# EAGLE design xport_shield_v1 (EAGLE 4.14)
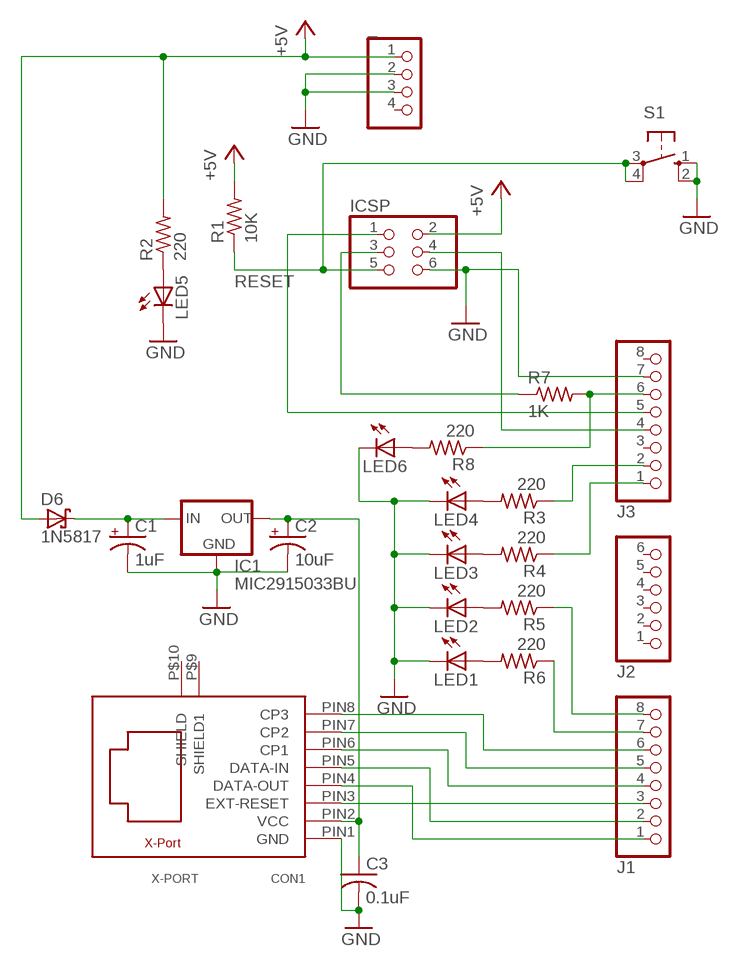
[diagram p0: schematic, sheet 1]

## Parts
_  PINHD-1X4  [1X04]
C1  1uF  CPOL-USE2.5-6  [E2,5-6]
C2  10uF  CPOL-USE2.5-6  [E2,5-6]
C3  0.1uF  2252MONOKAP  [2252MONOKAP]
CON1  X-PORT  [X-PORT]
D6  1N5817  SCHOTTKY-DIODE1N5817  [DO41-10]
IC1  MIC2915033BU  MIC29150XXBU  [TO-263]
ICSP  PINHD-2X3  [2X03]
J1  PINHD-1X8  [1X08]
J2  PINHD-1X6  [1X06]
J3  PINHD-1X8  [1X08]
LED1  LED3MM  [LED3MM]
LED2  LED3MM  [LED3MM]
LED3  LED3MM  [LED3MM]
LED4  LED3MM  [LED3MM]
LED5  LED3MM  [LED3MM]
LED6  LED3MM  [LED3MM]
R1  10K  R-US_0207/10  [0207/10]
R2  220  R-US_0207/10  [0207/10]
R3  220  R-US_0207/10  [0207/10]
R4  220  R-US_0207/10  [0207/10]
R5  220  R-US_0207/10  [0207/10]
R6  220  R-US_0207/10  [0207/10]
R7  1K  R-US_0207/10  [0207/10]
R8  220  R-US_0207/10  [0207/10]
S1  10-XX  [B3F-10XX]

## Nets
+5V: _.1 D6.A ICSP.2 R1.2 R2.2
GND: _.2 _.3 C1.- C2.- C3.P$2(-) CON1.PIN1(GND) IC1.P$2(GND) ICSP.6 J3.7 LED1.K(C) LED2.K(C) LED3.K(C) LED4.K(C) LED5.K(C) LED6.K(C) S1.1(S) S1.2(S1)
N$1: ICSP.5 R1.1 S1.3(P) S1.4(P1)
N$2: J3.6 R7.2 R8.1
N$3: ICSP.3 R7.1
N$4: ICSP.1 J3.5
N$5: ICSP.4 J3.4
N$6: C1.+ D6.C IC1.P$1(IN)
N$7: CON1.PIN3(EXT-RESET) J1.3
N$8: CON1.PIN4(DATA-OUT) J1.1
N$9: CON1.PIN5(DATA-IN) J1.2
N$10: CON1.PIN6(CP1) J1.4
N$11: CON1.PIN7(CP2) J1.5
N$12: CON1.PIN8(CP3) J1.6
N$13: LED4.A R3.2
N$14: LED3.A R4.2
N$15: LED2.A R5.2
N$16: LED1.A R6.2
N$17: LED5.A R2.1
N$18: C2.+ C3.P$1(+) CON1.PIN2(VCC) IC1.P$3(OUT)
N$19: J1.7 R6.1
N$20: J1.8 R5.1
N$21: J3.1 R4.1
N$22: J3.2 R3.1
N$23: LED6.A R8.2
Unconnected: _.4 CON1.P$9(SHIELD1) CON1.P$10(SHIELD) J2.1 J2.2 J2.3 J2.4 J2.5 J2.6 J3.3 J3.8

## Notes on the sheet
- RESET

## Library data of the parts
_ = pinhead:PINHD-1X4: PIN HEADER
C1 C2 = rcl:CPOL-US: POLARIZED CAPACITOR, American symbol
C3 = caps-bc-mono:2252MONOKAP
CON1 = x-port:X-PORT: LAN <-> RS232
D6 = diode-tom-extended:SCHOTTKY-DIODE: Schottky Diode
IC1 = v-reg-micrel-tom-extended:MIC29150XXBU
ICSP = pinhead:PINHD-2X3: PIN HEADER
J1 J3 = pinhead:PINHD-1X8: PIN HEADER
J2 = pinhead:PINHD-1X6: PIN HEADER
LED1-LED6 = led:LED: LED OSRAM: - CHIPLED LG R971, LG N971, LY N971, LG Q971, LY Q971, LO R971, LY R971 LH N974, LH R974 LS Q976, LO Q976, LY Q976 LO Q996 - Hyper CHIPLED LW Q18S LB Q993, LB Q99A, LB R99A - SideLED LS A670, LO A670, LY A670, LG A670, LP A670 LB A673, LV A673, LT A673, LW A673 LH A674 LY A675 LS A676, LA A676, LO A676, LY A676, LW A676 LS A679, LY A679, LG A679 - Hyper Micro SIDELED® LS Y876, LA Y876, LO Y876, LY Y876 LT Y87S - SmartLED LW L88C, LW L88S LB L89C, LB L89S, LG L890 LS L89K, LO L89K, LY L89K LS L896, LA L896, LO L896, LY L896 - TOPLED LS T670, LO T670, LY T670, LG T670, LP T670 LSG T670, LSP T670, LSY T670, LOP T670, LYG T670 LG T671, LOG T671, LSG T671 LB T673, LV T673, LT T673, LW T673 LH T674 LS T676, LA T676, LO T676, LY T676, LB T676, LH T676, LSB T676, LW T676 LB T67C, LV T67C, LT T67C, LS T67K, LO T67K, LY T67K, LW E67C LS E67B, LA E67B, LO E67B, LY E67B, LB E67C, LV E67C, LT E67C LW T67C LS T679, LY T679, LG T679 LS T770, LO T770, LY T770, LG T770, LP T770 LB T773, LV T773, LT T773, LW T773 LH T774 LS E675, LA E675, LY E675, LS T675 LS T776, LA T776, LO T776, LY T776, LB T776 LHGB T686 LT T68C, LB T68C - Hyper Mini TOPLED® LB M676 - Mini TOPLED Santana® LG M470 LS M47K, LO M47K, LY M47K Source: http://www.osram.convergy.de/
R1-R8 = rcl:R-US_: RESISTOR, American symbol
S1 = switch-omron:10-XX: OMRON SWITCH

## Board
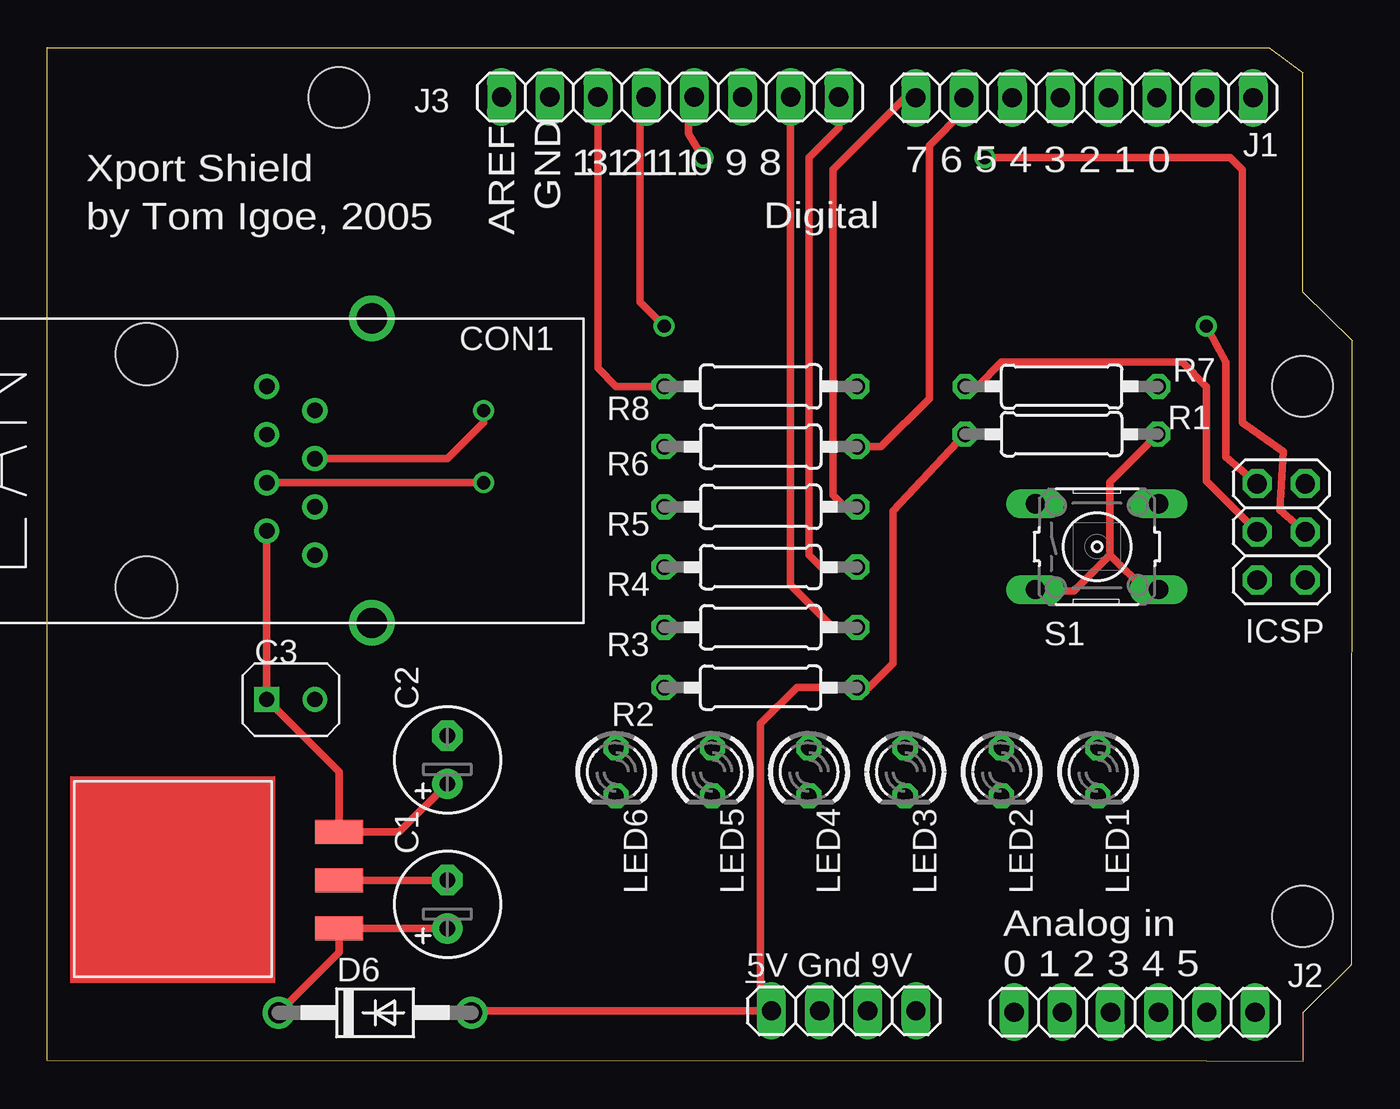
[diagram p1: board, top side]
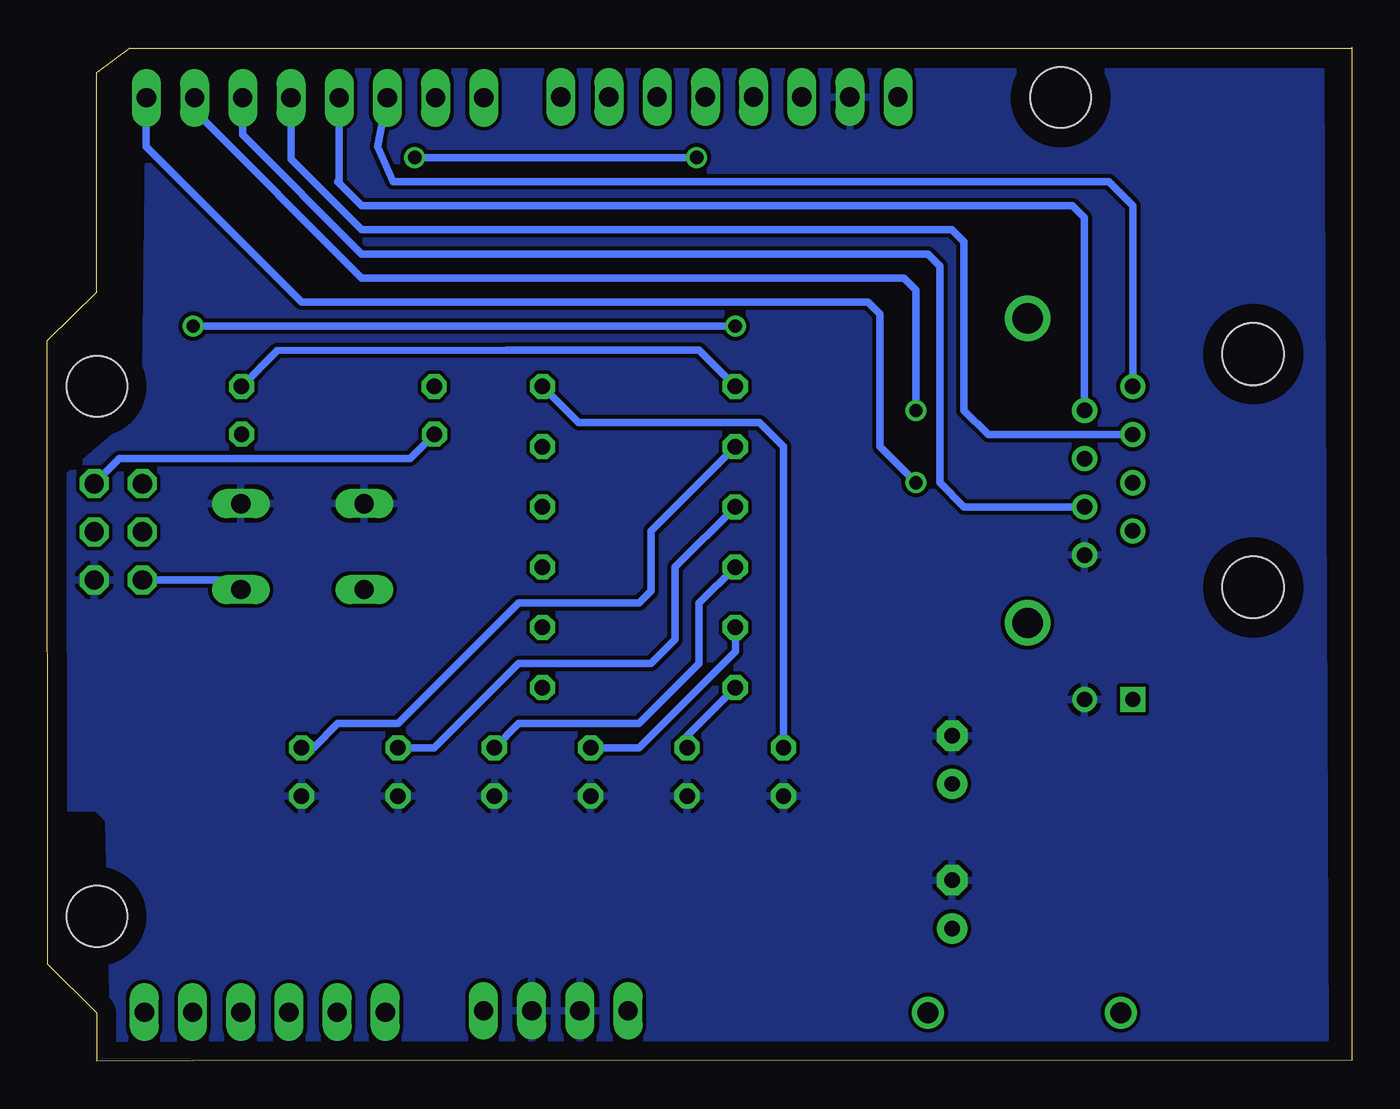
[diagram p2: board, bottom side, seen from below]

Size 68.77 x 53.44 mm. Coordinates in mm from the lower left corner, seen from the top.
Outline: 0,53.4 64.44,53.4 66.17,52.1 66.17,40.54 68.77,38 68.75,5.11
Outline: 0,53.4 0,53.44
Outline: 68.75,5.1 68.75,5.11
Outline: 68.75,5.11 66.17,2.55 66.19,0.05
Outline: 0,53.4 0,0.05 61.09,0.01 66.19,0
Copper layers (1*16): Top 0.035mm / dielectric 1.5mm / Bottom 0.035mm
Design rules "default": minimum track width 10mil, minimum drill 24mil, track to track 8mil, track to pad 8mil, pad to pad 8mil, via to via 8mil, smd to smd 8mil, copper to edge 40mil, drill to drill 10mil, minimum pad ring 10mil, minimum via ring 8mil, stop-mask expansion 4mil, vias tented up to drill 0mil, thermal gap 10mil
Holes 3.2 mm at 15.37,50.81 66.17,35.57 66.17,7.63

### Footprints (pad centres in the part's own frame; a part is rotated, then mirrored left to right if it is on the bottom)
1X04 = drill 1.016 long: 1 -3.81,0; 2 -1.27,0; 3 1.27,0; 4 3.81,0
E2,5-6 = drill 0.813 pad 1.6 round: + -1.27,0 | drill 0.813 pad 1.6 octagon: - 1.27,0
2252MONOKAP = drill 0.8 square: P$1 -2.54,-0.635 | drill 0.8 round: P$2 0,-0.635
X-PORT = drill 1.6 round: P$9 4.28,8.025; P$10 4.28,-8.025 | drill 0.813 round: PIN1 1.27,-4.445; PIN2 -1.27,-3.175; PIN3 1.27,-1.905; PIN4 -1.27,-0.635; PIN5 1.27,0.635; PIN6 -1.27,1.905; PIN7 1.27,3.175; PIN8 -1.27,4.445 | hole 3.25: -7.62,-6.15; -7.62,6.15
DO41-10 = drill 1.118 round: A 5.08,0; C -5.08,0
TO-263 = smd 1.27 x 2.54: P$1 -2.54,-8.89; P$2 0,-8.89; P$3 2.54,-8.89
2X03 = drill 1.016 octagon: 1 -2.54,-1.27; 2 -2.54,1.27; 3 0,-1.27; 4 0,1.27; 5 2.54,-1.27; 6 2.54,1.27
1X08 = drill 1.016 long: 1 -8.89,0; 2 -6.35,0; 3 -3.81,0; 4 -1.27,0; 5 1.27,0; 6 3.81,0; 7 6.35,0; 8 8.89,0
1X06 = drill 1.016 long: 1 -6.35,0; 2 -3.81,0; 3 -1.27,0; 4 1.27,0; 5 3.81,0; 6 6.35,0
LED3MM = drill 0.813 octagon: A -1.27,0; K 1.27,0
0207/10 = drill 0.813 octagon: 1 -5.08,0; 2 5.08,0
B3F-10XX = drill 1.016 long: 1 -3.251,2.261; 2 3.251,2.261; 3 -3.251,-2.261; 4 3.251,-2.261

### Placement (x,y rotation side)
_  41.97,2.65 0 top
C1  21.08,8.27 90 top
C2  21.08,15.89 90 top
C3  14.1,19.7 0 top
CON1  12.83,31.13 0 top
D6  17.27,2.55 0 top
IC1  6.48,9.54 90 top
ICSP  65.04,27.9 270 top
J1  54.67,50.79 180 top
J2  57.31,2.58 0 top
J3  32.83,50.83 180 top
LED1  55.38,15.25 270 top
LED2  50.3,15.25 270 top
LED3  45.22,15.25 270 top
LED4  40.14,15.25 270 top
LED5  35.05,15.25 270 top
LED6  29.97,15.25 270 top
R1  53.45,33.06 180 top
R2  37.6,19.7 0 top
R3  37.6,22.87 180 top
R4  37.6,26.05 180 top
R5  37.6,29.22 180 top
R6  37.6,32.4 180 top
R7  53.46,35.56 0 top
R8  37.6,35.57 0 top
S1  55.33,27.12 0 top

### Tracks (layer width: path | path; a pad name or v marks a point on that pad's centre or on a via)
+5V
  Top 0.406: D6.A 22.46,2.65 _.1 37.6,3.22 37.6,17.79 39.5,19.7 R2.2 43.31,19.7 44.58,20.97 44.58,29.01 R1.2
  Bottom 0.406: ICSP.2 64.99,31.76 49.66,31.76 48.39,33.03 48.39,33.04 R1.2
GND
  Top 0.406: IC1.P$2 C1.-
  pour Bottom: 1.65,52.21 63.38,52.21 63.63,34.3 68.07,30.49 68.07,13.35 66.17,13.35 65.53,12.71 65.28,1.15 1.4,1.15
N$1
  Top 0.406: R1.1 56.01,30.53 56.01,26.68 | S1.4 58.55,24.84 58.55,24.78 57.91,24.78 56.01,26.68 | S1.3 52.16,24.78 54.11,24.78 56.01,26.68
  Bottom 0.406: 58.55,24.86 58.55,24.78 | S1.4 58.55,24.86 | ICSP.5 58.55,25.36 58.55,24.86
N$2
  Top 0.406: J3.6 29.02,36.53 29.97,35.57 R8.1
  Bottom 0.406: R7.2 56.65,37.47 44.58,37.48 34.42,37.48 R8.1
N$3
  Top 0.406: ICSP.3 61.09,30.58 61.09,35.57 59.82,36.84 50.3,36.84 49.03,35.57 R7.1
N$4  (via drill 0.7)
  Top 0.406: ICSP.1 62.11,31.85 62.11,36.84 v61.09,38.75 | v32.52,38.75 31.24,40.02 31.24,50.18 J3.5
  Bottom 0.406: v32.52,38.75 v61.09,38.75
N$5  (via drill 0.7)
  Top 0.406: ICSP.4 64.96,29.06 65.15,32.14 63,33.67 63,47 62.36,47.64 v49.41,47.64 | J3.4 34.08,50.81 33.79,50.81 33.79,48.91 v34.55,47.64
  Bottom 0.406: v34.55,47.64 v49.41,47.64
N$6
  Top 0.406: C1.+ IC1.P$1 15.37,5.73 D6.C
N$7
  Bottom 0.406: J1.3 58.48,48.83 52.2,42.56 22.36,42.56 21.72,41.92 21.72,30.49 20.45,29.22 CON1.PIN3
N$8  (via drill 0.7)
  Top 0.406: CON1.PIN4 v22.99,30.49
  Bottom 0.406: J1.1 63.56,48.2 55.38,40.02 25.53,40.02 24.89,39.38 24.89,32.4 v22.99,30.49
N$9  (via drill 0.7)
  Top 0.406: v22.99,34.3 22.99,33.67 21.08,31.76 CON1.PIN5
  Bottom 0.406: J1.2 61.02,50.1 52.2,41.29 23.62,41.29 22.99,40.65 v22.99,34.3
N$10
  Bottom 0.406: J1.4 55.94,47.56 52.2,43.83 21.08,43.83 20.45,43.19 20.45,34.3 19.18,33.03 CON1.PIN6
N$11
  Bottom 0.406: J1.5 53.4,46.44 53.47,46.37 52.2,45.1 14.74,45.1 14.1,44.46 CON1.PIN7
N$12
  Bottom 0.406: J1.6 51.36,48.2 50.55,46.37 12.83,46.37 11.56,45.1 CON1.PIN8
N$13
  Bottom 0.406: R3.2 32.52,21.6 37.6,16.52 LED4.A
N$14
  Bottom 0.406: R4.2 34.42,24.14 34.42,20.97 37.6,17.79 43.95,17.79 LED3.A
N$15
  Bottom 0.406: R5.2 35.69,26.05 35.69,22.24 36.96,20.97 43.95,20.97 48.39,16.52 LED2.A
N$16
  Bottom 0.406: R6.2 36.96,27.95 36.96,24.78 37.6,24.14 43.95,24.14 50.3,17.79 53.47,17.79 54.74,16.52 LED1.A
N$17
  Bottom 0.406: R2.1 35.05,17.16 LED5.A
N$18
  Top 0.406: C2.+ 18.54,12.08 IC1.P$3 15.37,15.25 C3.P$1 CON1.PIN2
N$19
  Top 0.406: J1.7 48.32,50.1 46.48,48.27 46.48,34.94 43.95,32.4 R6.1
N$20
  Top 0.406: J1.8 45.19,50.79 41.41,47 41.41,29.86 42.04,29.22 R5.1
N$21
  Top 0.406: J3.1 41.72,49.22 40.14,47.64 40.14,26.68 40.77,26.05 R4.1
N$22
  Top 0.406: J3.2 39.18,25.1 41.41,22.87 R3.1
N$23
  Bottom 0.406: R8.2 40.77,33.67 31.24,33.67 29.97,32.4 LED6.A

### Text on the board
tNames: 1 1 1 1 | 3 2 1 0 9 8 | 7 6 5 4 3 2 1 0 | Xport Shield | GND | by Tom Igoe, 2005 | AREF | Digital | Analog in | 5V Gnd 9V | 0 1 2 3 4 5